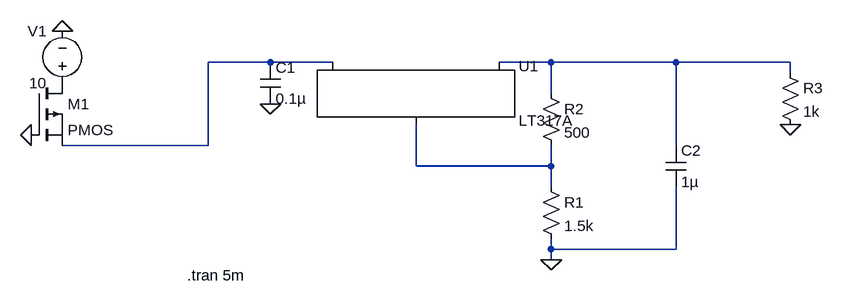
[diagram p0: schematic batt_in.asc]
batt_in.asc, the LTspice schematic file:
Version 4
SHEET 1 880 680
WIRE -32 112 -128 112
WIRE 64 112 -32 112
WIRE 400 112 320 112
WIRE 592 112 400 112
WIRE 768 112 592 112
WIRE 768 128 768 112
WIRE 400 160 400 112
WIRE -128 240 -128 112
WIRE -128 240 -352 240
WIRE 592 240 592 112
WIRE 192 272 192 208
WIRE 400 272 400 240
WIRE 400 272 192 272
WIRE 400 304 400 272
WIRE 400 400 400 384
WIRE 592 400 592 304
WIRE 592 400 400 400
WIRE 400 416 400 400
FLAG -32 176 0
FLAG 400 416 0
FLAG -400 224 0
FLAG -352 64 0
FLAG 768 208 0
SYMBOL PowerProducts\\LT317A 192 112 R0
SYMATTR InstName U1
SYMBOL cap -48 112 R0
SYMATTR InstName C1
SYMATTR Value 0.1µ
SYMBOL res 384 288 R0
SYMATTR InstName R1
SYMATTR Value 1.5k
SYMBOL res 384 144 R0
SYMATTR InstName R2
SYMATTR Value 500
SYMBOL cap 576 240 R0
SYMATTR InstName C2
SYMATTR Value 1µ
SYMBOL pmos -400 144 R0
SYMATTR InstName M1
SYMBOL voltage -352 160 R180
WINDOW 0 24 96 Left 2
WINDOW 3 24 16 Left 2
WINDOW 123 0 0 Left 0
WINDOW 39 0 0 Left 0
SYMATTR InstName V1
SYMATTR Value 10
SYMBOL res 752 112 R0
SYMATTR InstName R3
SYMATTR Value 1k
TEXT -160 440 Left 2 !.tran 5m

The netlist it stands for:
* batt_in.asc
XU1 N003 N002 N001 LT317A
C1 N001 0 0.1µ
R1 N003 0 1.5k
R2 N002 N003 500
C2 N002 0 1µ
M1 P001 0 N001 N001 PMOS
V1 P001 0 10
R3 N002 0 1k
.model NMOS NMOS
.model PMOS PMOS
.lib standard.mos
.tran 5m
.lib LTC.lib
.backanno
.end